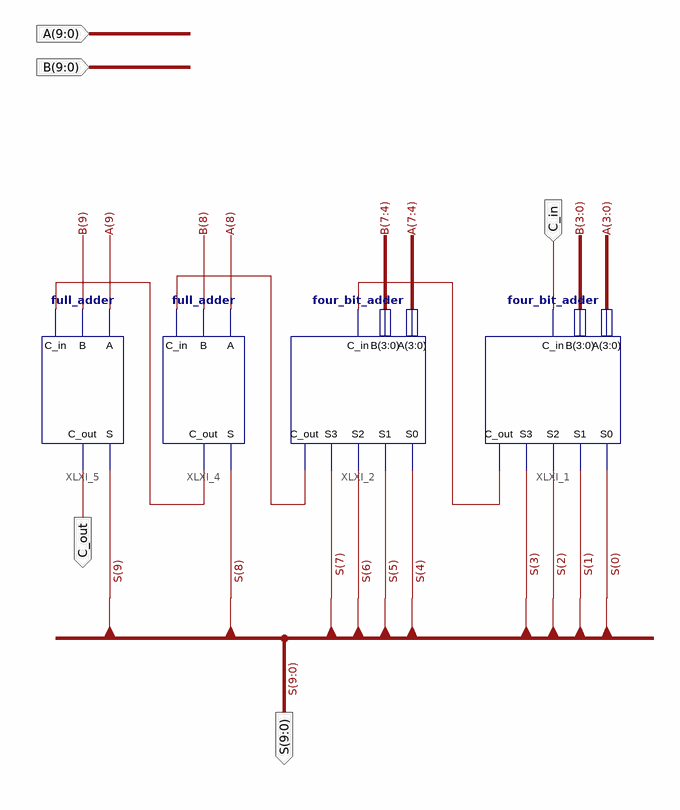
[diagram p0: schematic sheet 1]
// Xilinx ISE schematic ten_bit_adder.sch (artix7) as structural Verilog: 4 symbols, 5 ports
module ten_bit_adder (
  input  [9:0] A,
  input  [9:0] B,
  input  C_in,
  output [9:0] S,
  output C_out
);

  wire XLXN_3, XLXN_11, XLXN_12;

  four_bit_adder XLXI_1 (
    .A(A[3:0]), .B(B[3:0]), .C_in(C_in), .C_out(XLXN_3), .S0(S[0]), .S1(S[1]), .S2(S[2]), .S3(S[3]));
  four_bit_adder XLXI_2 (
    .A(A[7:4]), .B(B[7:4]), .C_in(XLXN_3), .C_out(XLXN_11), .S0(S[4]), .S1(S[5]), .S2(S[6]), .S3(S[7]));
  full_adder XLXI_4 (.A(A[8]), .B(B[8]), .C_in(XLXN_11), .C_out(XLXN_12), .S(S[8]));
  full_adder XLXI_5 (.A(A[9]), .B(B[9]), .C_in(XLXN_12), .C_out(C_out), .S(S[9]));
endmodule
